# EAGLE design darwin-sonar-sensor (EAGLE 9.4.2)
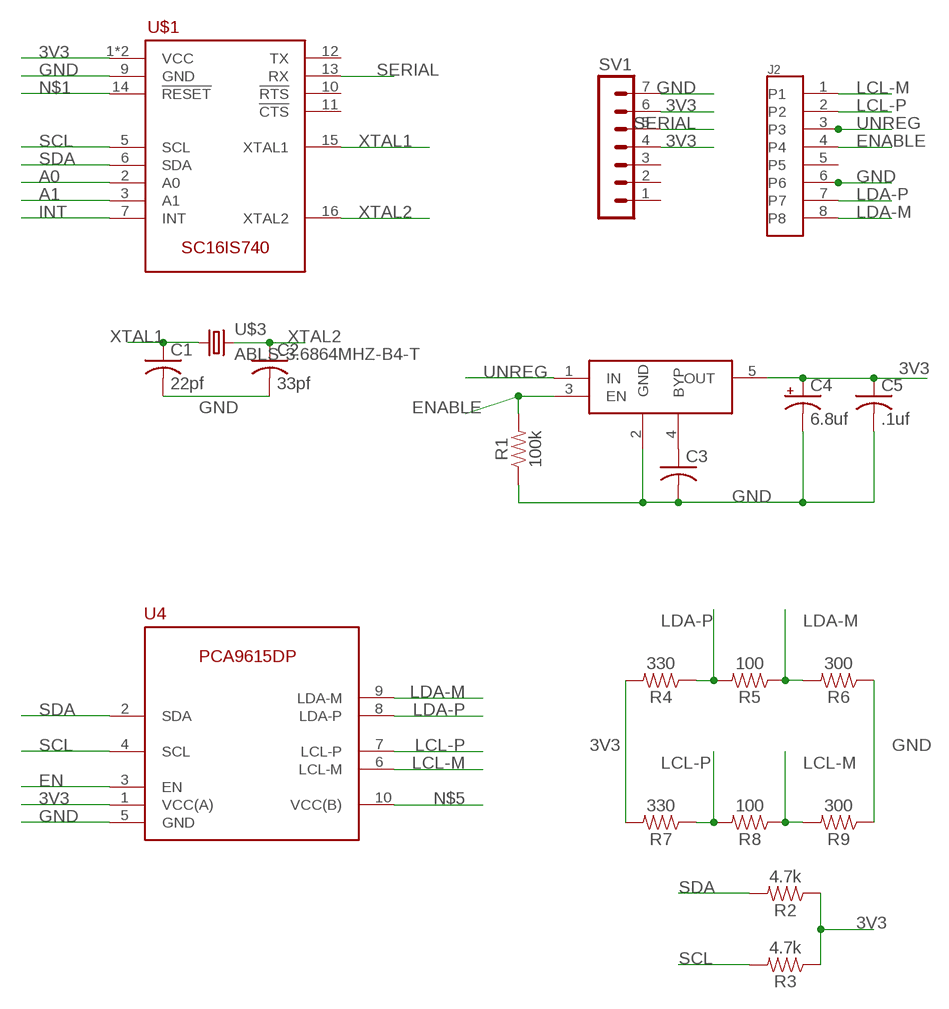
[diagram p0: schematic, sheet 1]

## Parts
C1  22pf  C-USC0603K  [C0603K]
C2  33pf  C-USC0603K  [C0603K]
C3  C-USC0603K  [C0603K]
C4  6.8uf  CPOL-USA/3216-18R  [A/3216-18R]
C5  .1uf  C-USC0603K  [C0603K]
J2  95501-6889VERT  [85513-5009]
R1  100k  100KOHM-0603-1/10W-1%  [0603]
R2  4.7k  100KOHM-0603-1/10W-1%  [0603]
R3  4.7k  100KOHM-0603-1/10W-1%  [0603]
R4  330  100KOHM-0603-1/10W-1%  [0603]
R5  100  100KOHM-0603-1/10W-1%  [0603]
R6  300  100KOHM-0603-1/10W-1%  [0603]
R7  330  100KOHM-0603-1/10W-1%  [0603]
R8  100  100KOHM-0603-1/10W-1%  [0603]
R9  300  100KOHM-0603-1/10W-1%  [0603]
SV1  MA07-1  [MA07-1]
U4  PCA9615  [SOP50P490X110-10]
U$1  SC16IS740  [SOP65P640X110-16]
U$3  ABLS-3.6864MHZ-B4-T  [ABLS]
U$4  MIC5219-3.3YM5-TR  [SOT95P280X145-5]

## Nets
3V3: C4.+ C5.1 R2.1 R3.1 R4.2 R7.2 SV1.4 SV1.6 U4.1(VCC(A)) U$1.1(VCC) U$1.8(VCC) U$4.5(OUT)
A0: U$1.2(A0)
A1: U$1.3(A1)
EN: U4.3(EN)
ENABLE: J2.4 R1.2 U$4.3(EN)
GND: C1.2 C2.2 C3.2 C4.- C5.2 J2.6 R1.1 R6.1 R9.1 SV1.7 U4.5(GND) U$1.9(GND) U$4.2(GND)
INT: U$1.7(INT)
LCL-M: J2.1 R8.1 R9.2 U4.6(LCL-M)
LCL-P: J2.2 R7.1 R8.2 U4.7(LCL-P)
LDA-M: J2.8 R5.1 R6.2 U4.9(LDA-M)
LDA-P: J2.7 R4.1 R5.2 U4.8(LDA-P)
N$1: U$1.14(!RESET)
N$2: C3.1 U$4.4(BYP)
N$5: U4.10(VCC(B))
SCL: R3.2 U4.4(SCL) U$1.5(SCL)
SDA: R2.2 U4.2(SDA) U$1.6(SDA)
SERIAL: SV1.5 U$1.13(RX)
UNREG: J2.3 U$4.1(IN)
XTAL1: C1.1 U$1.15(XTAL1) U$3.P$1
XTAL2: C2.1 U$1.16(XTAL2) U$3.P$2
Unconnected: J2.5 SV1.1 SV1.2 SV1.3 U$1.10(!RTS) U$1.11(!CTS) U$1.12(TX)

## Library data of the parts
C1-C3 C5 = rcl:C-US: CAPACITOR, American symbol; SPICEPREFIX: C
C4 = rcl:CPOL-US: POLARIZED CAPACITOR, American symbol; SPICEPREFIX: C
J2 = Conservify:95501-6889: Molex RJ-45 Connector
R1 = SparkFun-Resistors:100KOHM: 100kΩ resistor A resistor is a passive two-terminal electrical component that implements electrical resistance as a circuit element. Resistors act to reduce current flow, and, at the same time, act to lower voltage levels within circuits. - Wikipedia; PROD_ID: RES-07828
R2-R9 = SparkFun-Resistors:100KOHM: 100kΩ resistor A resistor is a passive two-terminal electrical component that implements electrical resistance as a circuit element. Resistors act to reduce current flow, and, at the same time, act to lower voltage levels within circuits. - Wikipedia; PROD_ID: RES-07828; VALUE: 100k
SV1 = con-lstb:MA07-1: PIN HEADER; OC_FARNELL: unknown; OC_NEWARK: unknown
U4 = Conservify:PCA9615
U$1 = Conservify:SC16IS740
U$3 = Conservify:ABLS-3.6864MHZ-B4-T
U$4 = Conservify:MIC5219-3.3YM5-TR

## Board
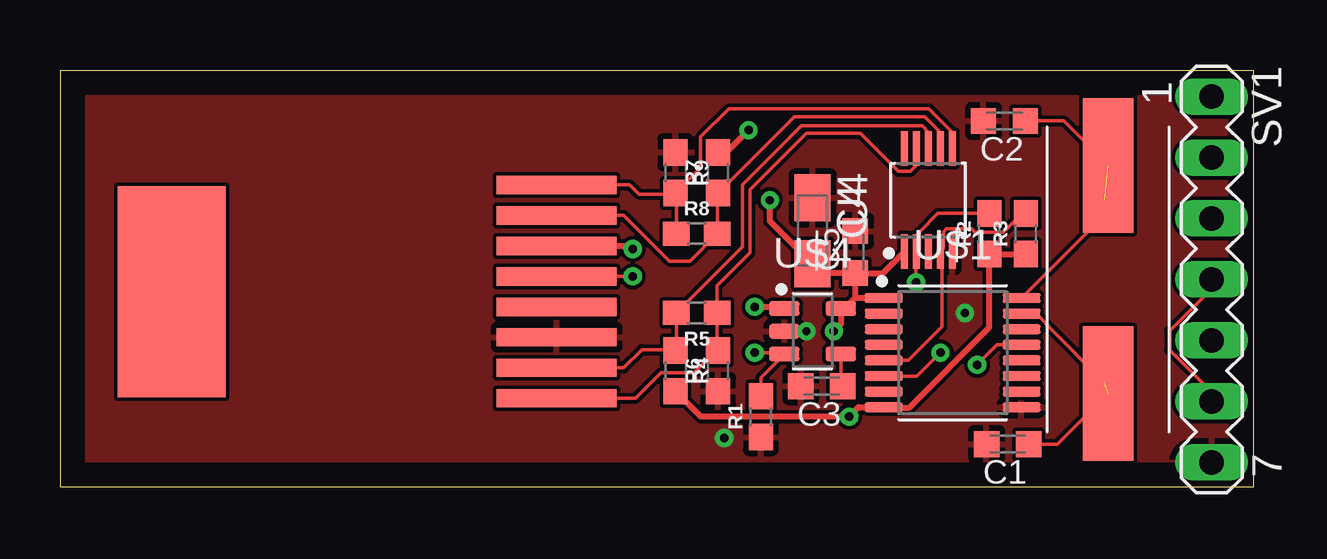
[diagram p1: board, top side]
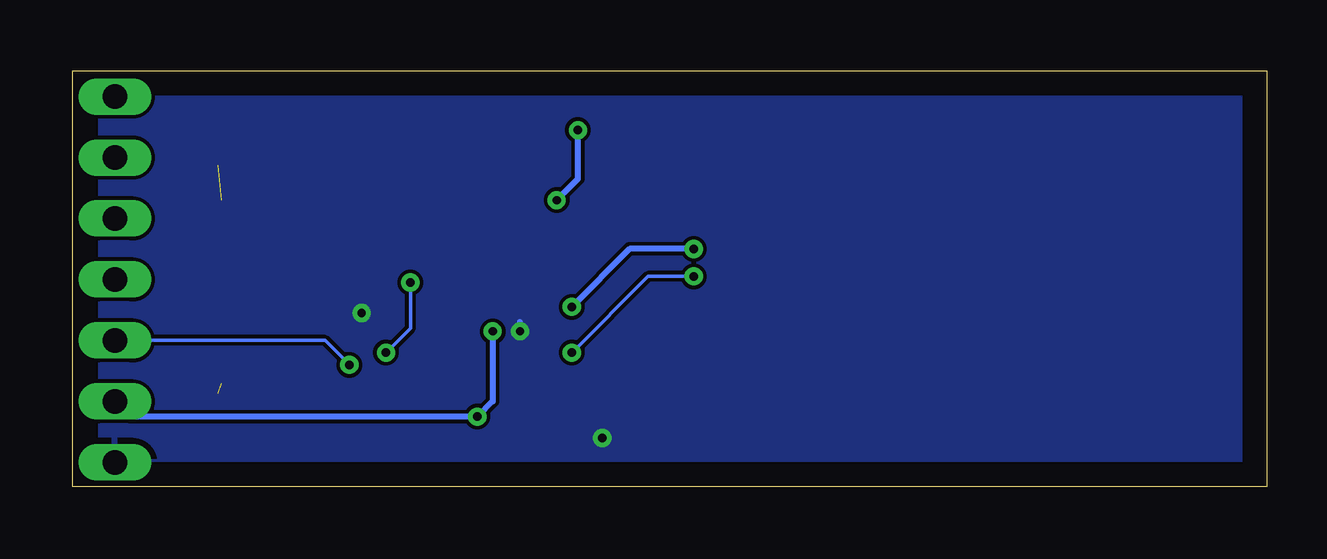
[diagram p2: board, bottom side, seen from below]

Size 49.76 x 17.32 mm. Coordinates in mm from the lower left corner, seen from the top.
Outline: 0,0 49.76,0 49.76,17.32 0,17.32 0,0
Copper layers (1*16): Top 0.035mm / dielectric 1.5mm / Bottom 0.035mm
Design rules "default": minimum track width 6mil, minimum drill 0.35mm, track to track 6mil, track to pad 6mil, pad to pad 6mil, via to via 6mil, smd to smd 6mil, copper to edge 40mil, drill to drill 6mil, minimum pad ring 10mil, minimum via ring 8mil, stop-mask expansion 4mil, vias tented up to drill 0mil, thermal gap 10mil

### Footprints (pad centres in the part's own frame; a part is rotated, then mirrored left to right if it is on the bottom)
C0603K = smd 1.05 x 1.08: 1 -0.875,0; 2 0.875,0
A/3216-18R = smd 1.95 x 1.5: + 1.375,0; - -1.375,0
85513-5009 = smd 0.76 x 5: 1 4.445,0; 2 3.175,0; 3 1.905,0; 4 0.635,0; 5 -0.635,0; 6 -1.905,0; 7 -3.175,0; 8 -4.445,0 | smd 8.8 x 4.5: P$1 0,16.05
0603 = smd 1.1 x 1: 1 -0.85,0; 2 0.85,0
MA07-1 = drill 1.016 long: 1 -7.62,0; 2 -5.08,0; 3 -2.54,0; 4 0,0; 5 2.54,0; 6 5.08,0; 7 7.62,0
SOP50P490X110-10 = smd 1.438 x 0.297: 1 -2.145,1; 2 -2.145,0.5; 3 -2.145,0; 4 -2.145,-0.5; 5 -2.145,-1; 6 2.145,-1; 7 2.145,-0.5; 8 2.145,0; 9 2.145,0.5; 10 2.145,1
SOP65P640X110-16 = smd 1.572 x 0.407: 1 -2.872,2.275; 2 -2.872,1.625; 3 -2.872,0.975; 4 -2.872,0.325; 5 -2.872,-0.325; 6 -2.872,-0.975; 7 -2.872,-1.625; 8 -2.872,-2.275; 9 2.872,-2.275; 10 2.872,-1.625; 11 2.872,-0.975; 12 2.872,-0.325; 13 2.872,0.325; 14 2.872,0.975; 15 2.872,1.625; 16 2.872,2.275
ABLS = smd 5.588 x 2.108: P$1 -4.75,0; P$2 4.75,0
SOT95P280X145-5 = smd 1.262 x 0.609: 1 -1.175,0.95; 2 -1.175,0; 3 -1.175,-0.95; 4 1.175,-0.95; 5 1.175,0.95

### Placement (x,y rotation side)
C1  39.5,1.78 180 top
C2  39.37,15.24 180 top
C3  31.75,4.19 180 top
C4  31.37,10.67 270 top
C5  33.15,9.78 90 top
J2  20.7,8.13 90 top
R1  29.21,2.92 90 top
R2  38.73,10.54 90 top
R3  40.26,10.54 90 top
R4  25.65,4.83 270 top
R5  26.54,7.24 180 top
R6  27.43,4.83 90 top
R7  27.43,13.08 90 top
R8  26.54,10.54 0 top
R9  25.65,13.08 270 top
SV1  48.01,8.64 270 top
U4  36.2,11.94 90 top
U$1  37.21,5.59 0 top
U$3  43.69,8.64 90 top
U$4  31.37,6.48 0 top

### Tracks (layer width: path | path; a pad name or v marks a point on that pad's centre or on a via)
3V3  (via drill 0.35)
  Top 0.152: 33.15,7.9 33.15,8.13 | 31.76,8.9 C4.+ | SV1.4 48.01,8.26 46.25,6.51 46.25,5.69 48.01,3.93 SV1.6
  Top 0.254: 33.15,7.9 32.67,7.43 U$4.5 32.54,6.76 v32.26,6.48 | C5.1 33.15,8.13 33.15,7.87 34.33,7.87 U$1.1 | C5.1 31.76,8.9 | C5.1 34.31,8.9 U4.1 | R4.2 26.71,2.92 v32.89,2.92 33.28,3.31 U$1.8 34.38,3.28 35.38,3.28 38.73,6.63 R2.1 R3.1 | C4.+ 29.59,11.07 v29.59,11.94 | v28.7,14.86 27.77,13.93 R7.2
  Bottom 0.254: v32.26,6.48 32.26,3.56 v32.89,2.92 47.37,2.92 SV1.6 | v29.59,11.94 28.7,12.83 v28.7,14.86
ENABLE  (via drill 0.35)
  Top 0.152: R1.2 29.21,4.54 U$4.3 30.13,5.59 v28.96,5.59 | J2.4 v23.88,8.76
  Bottom 0.152: v23.88,8.76 25.78,8.76 v28.96,5.59
GND  (via drill 0.35)
  Top 0.254: U$4.2 v31.11,6.48
  Bottom 0.254: v31.11,6.48 31.11,6.86
  other vias: 37.72,7.24 27.69,2.03
  pour Bottom: 0.38,17.02 48.64,17.02 48.64,0.51 0.38,0.51
  pour Top: 0.38,17.02 48.64,17.02 48.64,0.51 0.38,0.51
LCL-M
  Top 0.152: U4.6 37.2,14.77 36.22,15.75 27.88,15.75 26.7,14.58 26.7,13.28 R9.2 | R9.2 25.69,12.19 R8.1 | J2.1 23.75,12.57 24.13,12.19 25.62,12.19 R9.2
LCL-P
  Top 0.152: U4.7 36.7,14.77 36.06,15.41 30.61,15.41 R7.1 R8.2 26.25,9.4 25.4,9.4 23.5,11.3 J2.2
LDA-M
  Top 0.152: U4.9 35.7,13.4 35.44,13.14 34.95,13.14 33.36,14.73 31.11,14.73 28.75,12.37 28.75,9.74 27.39,8.38 R5.1 27.39,5.71 | 27.39,5.71 R6.2 | J2.8 23.99,3.68 25.06,4.76 26.43,4.76 27.39,5.71
LDA-P
  Top 0.152: U4.8 36.2,14.77 35.94,15.03 30.91,15.03 28.45,12.57 28.45,9.99 R5.2 25.69,5.71 R4.1 25.62,5.71 24.26,5.71 23.5,4.95 J2.7
N$2
  Top 0.152: U$4.4 32.54,4.27 C3.1
SCL
  Top 0.152: U4.4 36.76,9.85 | 36.76,9.85 36.82,9.91 36.82,10.61 36.95,10.74 38.01,10.74 38.14,10.61 39.33,10.61 40.11,11.39 R3.2 | U$1.5 35.36,5.26 36.76,6.66 36.76,9.85
SDA  (via drill 0.35)
  Top 0.152: R2.2 36.6,11.39 35.82,10.61 35.82,9.91 U4.2 v35.69,8.51 | U$1.6 35.73,4.61 v36.7,5.59
  Bottom 0.152: v36.7,5.59 35.69,6.6 v35.69,8.51
SERIAL  (via drill 0.35)
  Top 0.152: U$1.13 39.06,5.91 v38.23,5.08
  Bottom 0.152: v38.23,5.08 39.24,6.1 SV1.5
UNREG  (via drill 0.35)
  Top 0.152: 30.13,7.49 U$4.1
  Top 0.254: J2.3 23.75,10.03 v23.88,9.91 | v28.96,7.49 30.13,7.49
  Bottom 0.254: v23.88,9.91 26.54,9.91 v28.96,7.49
XTAL1  (1 unrouted)
  Top 0.152: 43.56,4.32 41.1,6.78 41.1,6.81 40.7,7.21 U$1.15 | C1.1 41.58,1.78 U$3.P$1
XTAL2  (1 unrouted)
  Top 0.152: U$1.16 43.56,11.34 43.56,11.94 | C2.1 41.83,15.24 U$3.P$2